# EAGLE schematic Platypus_v1_0_Proto_v8_0 (EAGLE 7.2.0)
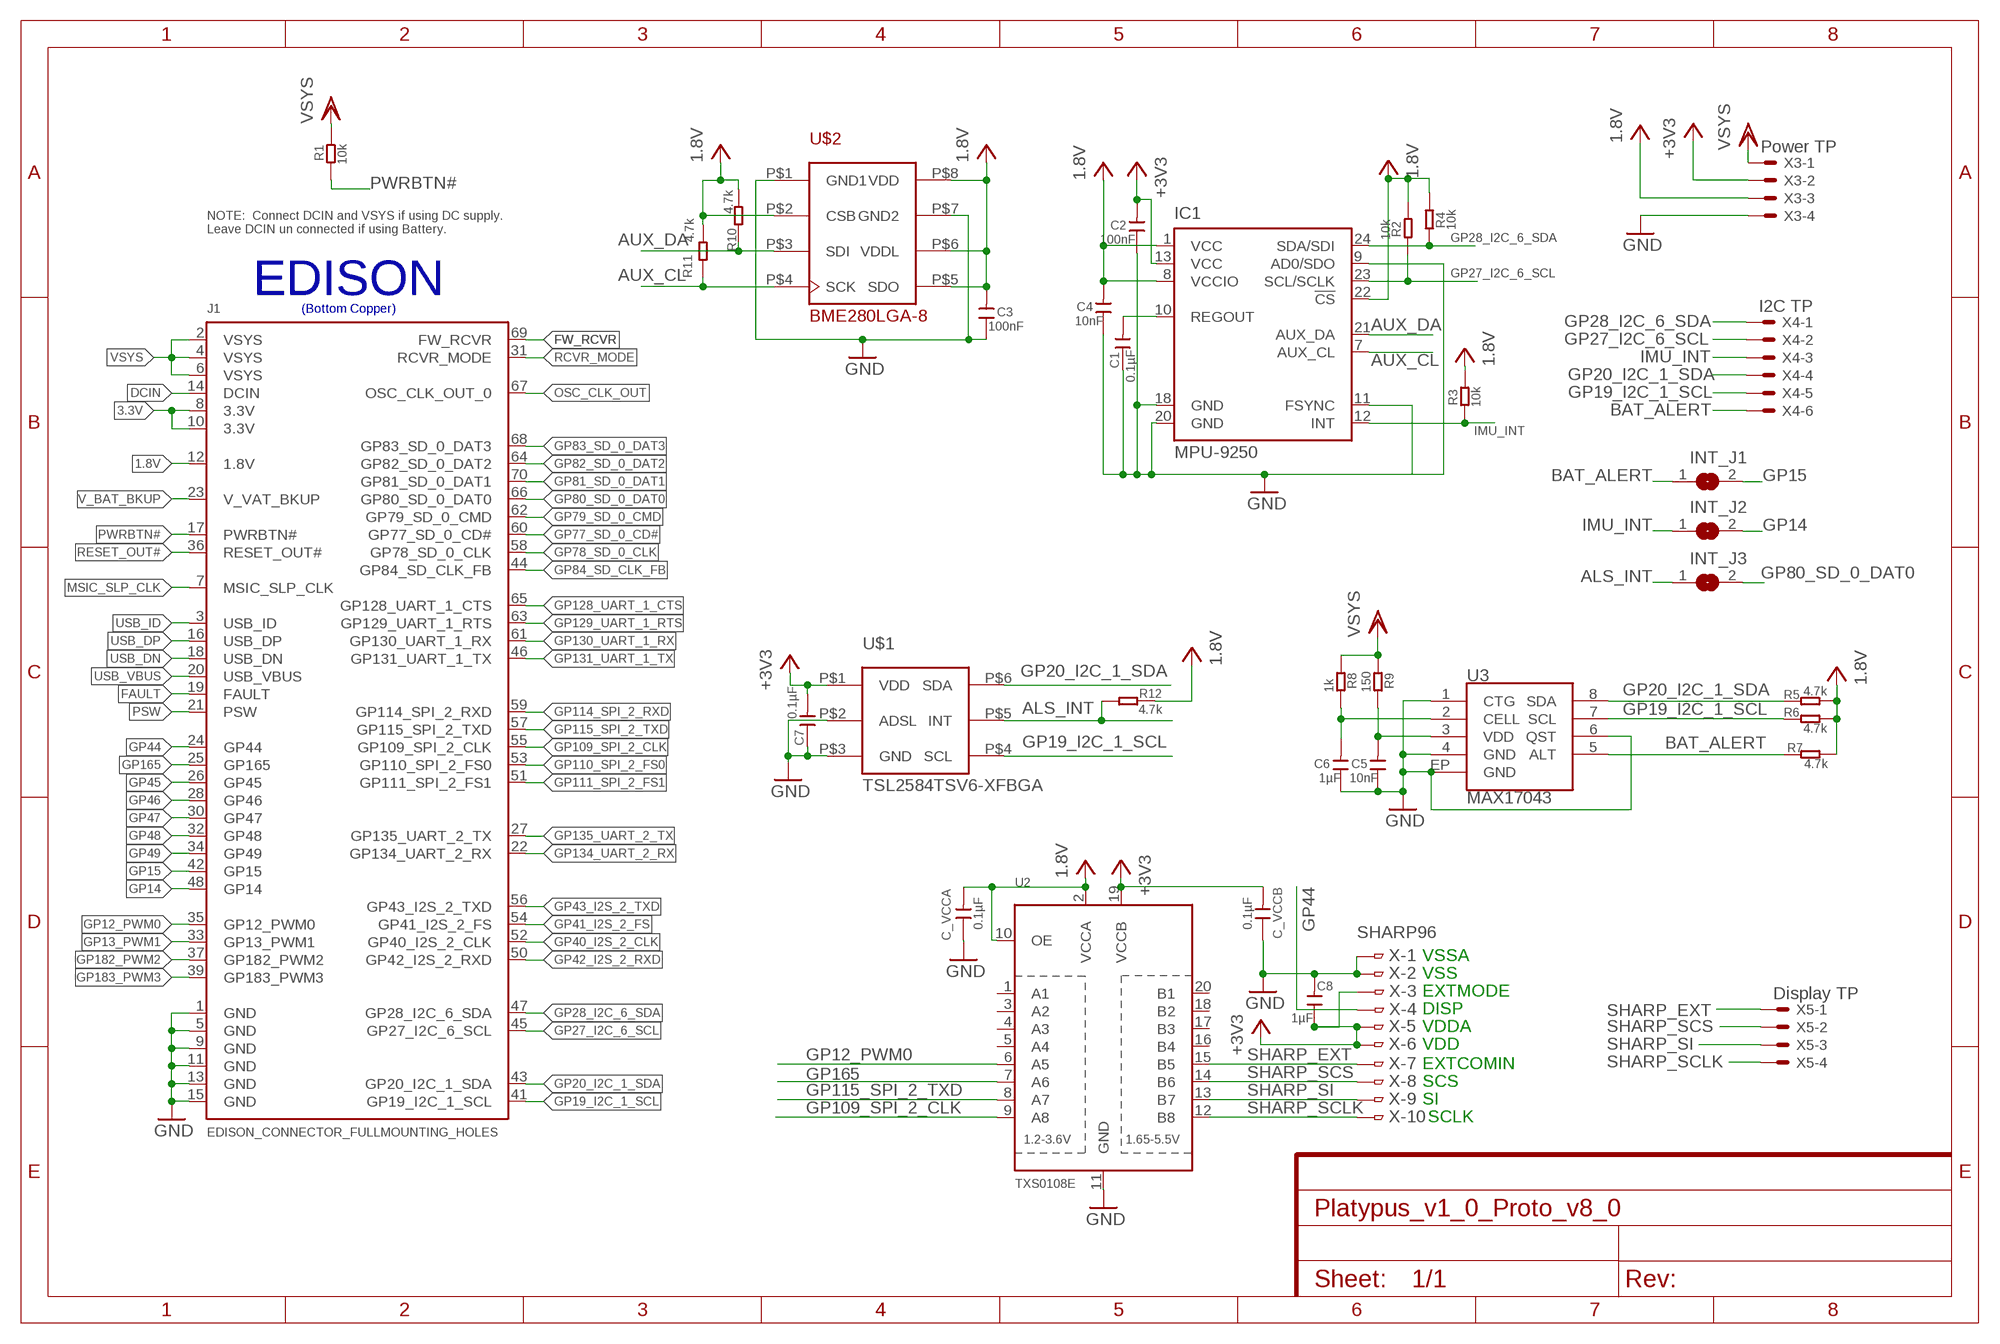
[diagram p0: schematic, sheet 1]

## Parts
C1  0.1µF  C-0603  [C0603]
C2  100nF  C-0603  [C0603]
C3  100nF  C-0603  [C0603]
C4  10nF  C-0603  [C0603]
C5  10nF  C-0603  [C0603]
C6  1µF  C-0603  [C0603]
C7  0.1µF  C-0603  [C0603]
C8  1µF  C-0603  [C0603]
C_VCCA  0.1µF  C-0603  [C0603]
C_VCCB  0.1µF  C-0603  [C0603]
IC1  MPU-9250  [QFN24-SMALL]
INT_J1  SJ  [SJ]
INT_J2  SJ  [SJ]
INT_J3  SJ  [SJ]
J1  EDISON_CONNECTOR_FULLMOUNTING_HOLES  [EDISON_DAUGHTER]
R1  10k  R-0603  [R0603]
R2  10k  R-0603  [R0603]
R3  10k  R-0603  [R0603]
R4  10k  R-0603  [R0603]
R5  4.7k  R-0603  [R0603]
R6  4.7k  R-0603  [R0603]
R7  4.7k  R-0603  [R0603]
R8  1k  R-0603  [R0603]
R9  150  R-0603  [R0603]
R10  4.7k  R-0603  [R0603]
R11  4.7k  R-0603  [R0603]
R12  4.7k  R-0603  [R0603]
U2  TXS0108E  TXB0108PWR  [TSSOP20]
U3  MAX17043  MAX1704X  [TDFN-8]
U$1  TSL2584TSV6-XFBGA  [6-XFBGA]
U$2  BME280LGA-8  [LGA-8]
X  SHARP96  FH12-10S-0.5SH  [FH12-10S-0.5SH]
X3  Power TP  53047-04  [53047-04]
X4  I2C TP  53047-06  [53047-06]
X5  Display TP  53047-04  [53047-04]

## Nets
1.8V: C3.2 C4.2 C_VCCA.2 IC1.1(VCC) IC1.8(VCCIO) IC1.22(!CS) J1.12(1.8V) R2.1 R3.2 R4.2 R5.2 R6.2 R7.1 R10.2 R11.2 R12.2 U2.2(VCCA) U2.10(OE) U$2.P$2(CSB) U$2.P$5(SDO) U$2.P$6(VDDL) U$2.P$8(VDD) X3.3
3.3V: C2.2 C7.2 C8.1 C_VCCB.2 IC1.13(VCC) J1.8(3.3V) J1.10(3.3V) U2.19(VCCB) U$1.P$1(VDD) X3.2 X.3 X.5 X.6 ; supply symbol labelled +3V3
ALS_INT: INT_J3.1 R12.1 U$1.P$5(INT)
AUX_CL: IC1.7(AUX_CL) R11.1 U$2.P$4(SCK)
AUX_DA: IC1.21(AUX_DA) R10.1 U$2.P$3(SDI)
BAT_ALERT: INT_J1.1 R7.2 U3.5(ALT) X4.6
DCIN: J1.14(DCIN)
FAULT: J1.19(FAULT)
FW_RCVR: J1.69(FW_RCVR)
GND: C1.1 C2.1 C3.1 C4.1 C5.1 C6.1 C7.1 C8.2 C_VCCA.1 C_VCCB.1 IC1.9(AD0/SDO) IC1.11(FSYNC) IC1.18(GND) IC1.20(GND) J1.1(GND) J1.5(GND) J1.9(GND) J1.11(GND) J1.13(GND) J1.15(GND) U2.11(GND) U3.1(CTG) U3.4(GND) U3.6(QST) U3.EP(GND) U$1.P$2(ADSL) U$1.P$3(GND) U$2.P$1(GND1) U$2.P$7(GND2) X3.4 X.1 X.2
GP12_PWM0: J1.35(GP12_PWM0) U2.6(A5)
GP13_PWM1: J1.33(GP13_PWM1)
GP14: INT_J2.2 J1.48(GP14)
GP15: INT_J1.2 J1.42(GP15)
GP19_I2C_1_SCL: J1.41(GP19_I2C_1_SCL) R6.1 U3.7(SCL) U$1.P$4(SCL) X4.5
GP20_I2C_1_SDA: J1.43(GP20_I2C_1_SDA) R5.1 U3.8(SDA) U$1.P$6(SDA) X4.4
GP27_I2C_6_SCL: IC1.23(SCL/SCLK) J1.45(GP27_I2C_6_SCL) R2.2 X4.2
GP28_I2C_6_SDA: IC1.24(SDA/SDI) J1.47(GP28_I2C_6_SDA) R4.1 X4.1
GP40_I2S_2_CLK: J1.52(GP40_I2S_2_CLK)
GP41_I2S_2_FS: J1.54(GP41_I2S_2_FS)
GP42_I2S_2_RXD: J1.50(GP42_I2S_2_RXD)
GP43_I2S_2_TXD: J1.56(GP43_I2S_2_TXD)
GP44: J1.24(GP44) X.4
GP45: J1.26(GP45)
GP46: J1.28(GP46)
GP47: J1.30(GP47)
GP48: J1.32(GP48)
GP49: J1.34(GP49)
GP77_SD_0_CD#: J1.60(GP77_SD_0_CD#)
GP78_SD_0_CLK: J1.58(GP78_SD_0_CLK)
GP79_SD_0_CMD: J1.62(GP79_SD_0_CMD)
GP80_SD_0_DAT0: INT_J3.2 J1.66(GP80_SD_0_DAT0)
GP81_SD_0_DAT1: J1.70(GP81_SD_0_DAT1)
GP82_SD_0_DAT2: J1.64(GP82_SD_0_DAT2)
GP83_SD_0_DAT3: J1.68(GP83_SD_0_DAT3)
GP84_SD_CLK_FB: J1.44(GP84_SD_CLK_FB)
GP109_SPI_2_CLK: J1.55(GP109_SPI_2_CLK) U2.9(A8)
GP110_SPI_2_FS0: J1.53(GP110_SPI_2_FS0)
GP111_SPI_2_FS1: J1.51(GP111_SPI_2_FS1)
GP114_SPI_2_RXD: J1.59(GP114_SPI_2_RXD)
GP115_SPI_2_TXD: J1.57(GP115_SPI_2_TXD) U2.8(A7)
GP128_UART_1_CTS: J1.65(GP128_UART_1_CTS)
GP129_UART_1_RTS: J1.63(GP129_UART_1_RTS)
GP130_UART_1_RX: J1.61(GP130_UART_1_RX)
GP131_UART_1_TX: J1.46(GP131_UART_1_TX)
GP134_UART_2_RX: J1.22(GP134_UART_2_RX)
GP135_UART_2_TX: J1.27(GP135_UART_2_TX)
GP165: J1.25(GP165) U2.7(A6)
GP182_PWM2: J1.37(GP182_PWM2)
GP183_PWM3: J1.39(GP183_PWM3)
IMU_INT: IC1.12(INT) INT_J2.1 R3.1 X4.3
MSIC_SLP_CLK: J1.7(MSIC_SLP_CLK)
N$5: C1.2 IC1.10(REGOUT)
N$6: C6.2 R8.1 U3.2(CELL)
N$13: C5.2 R9.1 U3.3(VDD)
OSC_CLK_OUT: J1.67(OSC_CLK_OUT_0)
PSW: J1.21(PSW)
PWRBTN#: J1.17(PWRBTN#) R1.1
RCVR_MODE: J1.31(RCVR_MODE)
RESET_OUT#: J1.36(RESET_OUT#)
SHARP_EXT: U2.15(B5) X5.1 X.7
SHARP_SCLK: U2.12(B8) X5.4 X.10
SHARP_SCS: U2.14(B6) X5.2 X.8
SHARP_SI: U2.13(B7) X5.3 X.9
USB_DN: J1.18(USB_DN)
USB_DP: J1.16(USB_DP)
USB_ID: J1.3(USB_ID)
USB_VBUS: J1.20(USB_VBUS)
V_BAT_BKUP: J1.23(V_VAT_BKUP)
VSYS: J1.2(VSYS) J1.4(VSYS) J1.6(VSYS) R1.2 R8.2 R9.2 X3.1
Unconnected: U2.1(A1) U2.3(A2) U2.4(A3) U2.5(A4) U2.16(B4) U2.17(B3) U2.18(B2) U2.20(B1)

## Notes on the sheet
- NOTE:  Connect DCIN and VSYS if using DC supply.
  Leave DCIN un connected if using Battery.
- EDISON
- (Bottom Copper)
- VSSA
- VSS
- EXTMODE
- DISP
- VDDA
- VDD
- EXTCOMIN
- SCS
- SI
- SCLK

## Library data of the parts
C1-C8 C_VCCA C_VCCB = Discrete:C*: Ceramic Capacitors
IC1 = invensense:MPU-9250: 9-axis MotionTracking device communicate with I2C/SPI Source: http://www.invensense.com/mems/gyro/documents/PS-MPU-9250A-01.pdf
INT_J1-INT_J3 = jumper:SJ: SMD solder JUMPER
J1 = Edison:EDISON_CONNECTOR_FULL
R1-R12 = Discrete:R*
U2 = adafruit:TXB0108PWR: 8-Bit Bi-Directional Level Shifter 1.2V-3.6V (VCCA) to 1.65V-5.5V (VCCB) bi-directional level shifter with auto direction sensing. Max data rate - VCCA 1.8V: 20Mbps (50ns), VCCA 3.3V: 100Mbps (10ns) Digikey: 296-21527-1-ND
U3 = SparkFun-PowerIC:MAX1704X: MAX17043/MAX17044: Battery Fuel Guage (43 is 1cell, 44 is 2cell); PROD-ID: IC-10399
U$1 = TSL2584TSV:TSL2584TSV
U$2 = BME280:BME280
X = con-hirose:FH12-10S-0.5S: 0.5mm Pitch Connectors For FPC/FFC Source: Data sheet <http://www.hirose.co.jp/cataloge_hp/e58605370.pdf>; MPN: FH12-10S-0.5SH(55); OC_FARNELL: 1324540; OC_NEWARK: 34M6152
X3 X5 = con-molex:53?-04: CONNECTOR wire to board 1.25 mm (.049 inch) pitch header; MF: WALDOM/MOLEX; MPN: 53047-0410; OC_FARNELL: 9733060; OC_NEWARK: 38C9900
X4 = con-molex:53?-06: CONNECTOR wire to board 1.25 mm (.049 inch) pitch header; MPN: 53047-0610-C; OC_FARNELL: 9733078; OC_NEWARK: 03M2965